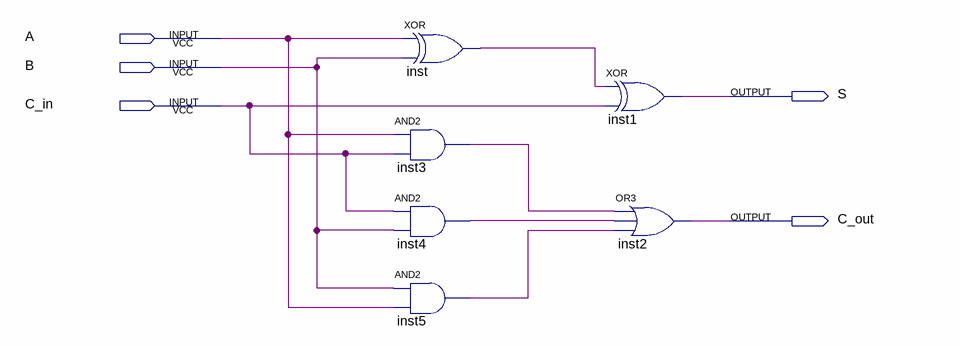
[diagram p0: schematic sheet]
// Quartus schematic Somador.bdf as structural Verilog: 6 symbols, 5 pins
module Somador (
  input  A,
  input  B,
  input  C_in,
  output S,
  output C_out
);

  wire inst3_out, inst4_out, inst5_out, inst_out;

  and inst3 (inst3_out, A, C_in);
  and inst4 (inst4_out, C_in, B);
  and inst5 (inst5_out, B, A);
  xor inst (inst_out, A, B);
  xor inst1 (S, inst_out, C_in);
  or inst2 (C_out, inst3_out, inst4_out, inst5_out);
endmodule
